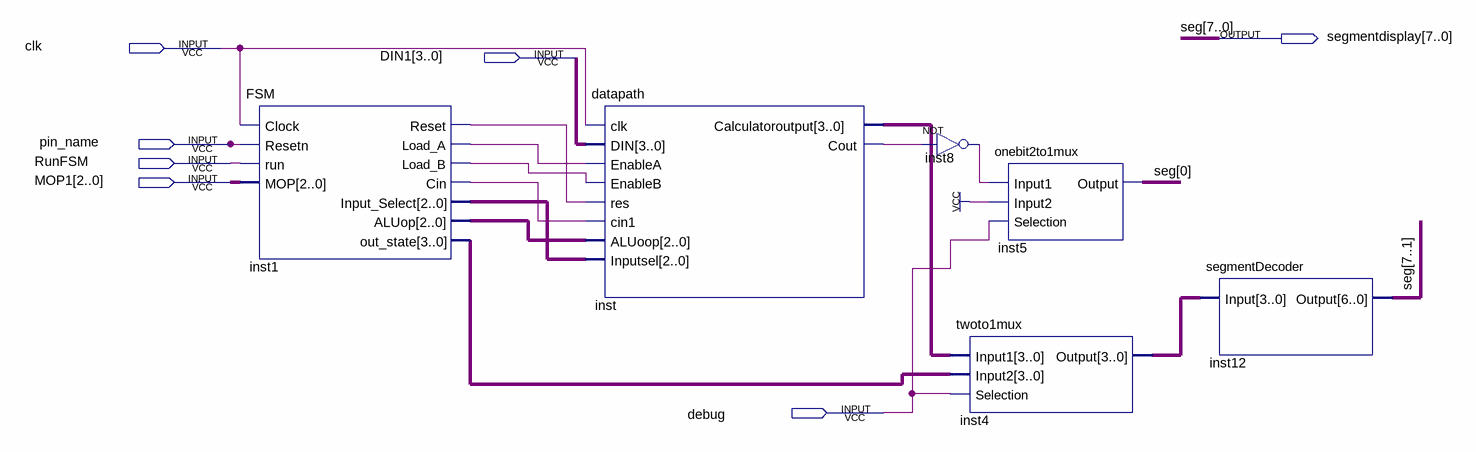
[diagram p0: schematic sheet]
// Quartus schematic Fsmanddatapath.bdf as structural Verilog: 6 symbols, 7 pins
module Fsmanddatapath (
  input  clk,
  input  [3:0] DIN1,
  input  pin_name,
  input  RunFSM,
  input  [2:0] MOP1,
  input  debug,
  output [7:0] segmentdisplay
);

  wire inst1_cin, inst1_load_a, inst1_load_b, inst1_reset, inst8_out, inst_cout;
  wire [2:0] inst1_aluop, inst1_input_select;
  wire [3:0] inst1_out_state, inst4_output, inst_calculatoroutput;

  FSM inst1 (
    .Clock(clk), .Resetn(pin_name), .run(RunFSM), .MOP(MOP1), .Reset(inst1_reset), .Load_A(inst1_load_a),
    .Load_B(inst1_load_b), .Cin(inst1_cin), .Input_Select(inst1_input_select), .ALUop(inst1_aluop),
    .out_state(inst1_out_state));
  datapath inst (
    .clk(clk), .DIN(DIN1), .EnableA(inst1_load_a), .EnableB(inst1_load_b), .res(inst1_reset),
    .cin1(inst1_cin), .ALUoop(inst1_aluop), .Inputsel(inst1_input_select),
    .Calculatoroutput(inst_calculatoroutput), .Cout(inst_cout));
  not inst8 (inst8_out, inst_cout);
  onebit2to1mux inst5 (.Input1(inst8_out), .Input2(1'b1), .Selection(debug), .Output(segmentdisplay[0]));
  twoto1mux inst4 (.Input1(inst_calculatoroutput), .Input2(inst1_out_state), .Selection(debug), .Output(inst4_output));
  segmentDecoder inst12 (.Input(inst4_output), .Output(segmentdisplay[7:1]));

  // Other names for the same wires on the sheet: seg[7:0] = segmentdisplay
endmodule
